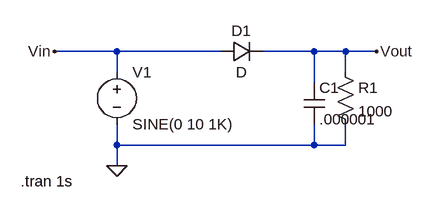
[diagram p0: schematic HalfWaveRectifier.asc]
HalfWaveRectifier.asc, the LTspice schematic file:
Version 4
SHEET 1 880 680
WIRE 32 144 -64 144
WIRE 192 144 32 144
WIRE 336 144 256 144
WIRE 384 144 336 144
WIRE 432 144 384 144
WIRE 32 176 32 144
WIRE 384 176 384 144
WIRE 336 192 336 144
WIRE 32 288 32 256
WIRE 336 288 336 256
WIRE 336 288 32 288
WIRE 384 288 384 256
WIRE 384 288 336 288
WIRE 32 320 32 288
FLAG 32 320 0
FLAG -64 144 Vin
FLAG 432 144 Vout
SYMBOL diode 192 160 R270
WINDOW 0 32 32 VTop 2
WINDOW 3 0 32 VBottom 2
SYMATTR InstName D1
SYMBOL voltage 32 160 R0
WINDOW 123 0 0 Left 0
WINDOW 39 0 0 Left 0
SYMATTR InstName V1
SYMATTR Value SINE(0 10 1K)
SYMBOL res 368 160 R0
SYMATTR InstName R1
SYMATTR Value 1000
SYMBOL cap 320 192 R0
SYMATTR InstName C1
SYMATTR Value .000001
TEXT -116 344 Left 2 !.tran 1s

The netlist it stands for:
* HalfWaveRectifier.asc
D1 Vin Vout D
V1 Vin 0 SINE(0 10 1K)
R1 Vout 0 1000
C1 Vout 0 .000001
.model D D
.lib standard.dio
.tran 1s
.backanno
.end